# EAGLE design bristol_longshot (EAGLE 6.5.0)
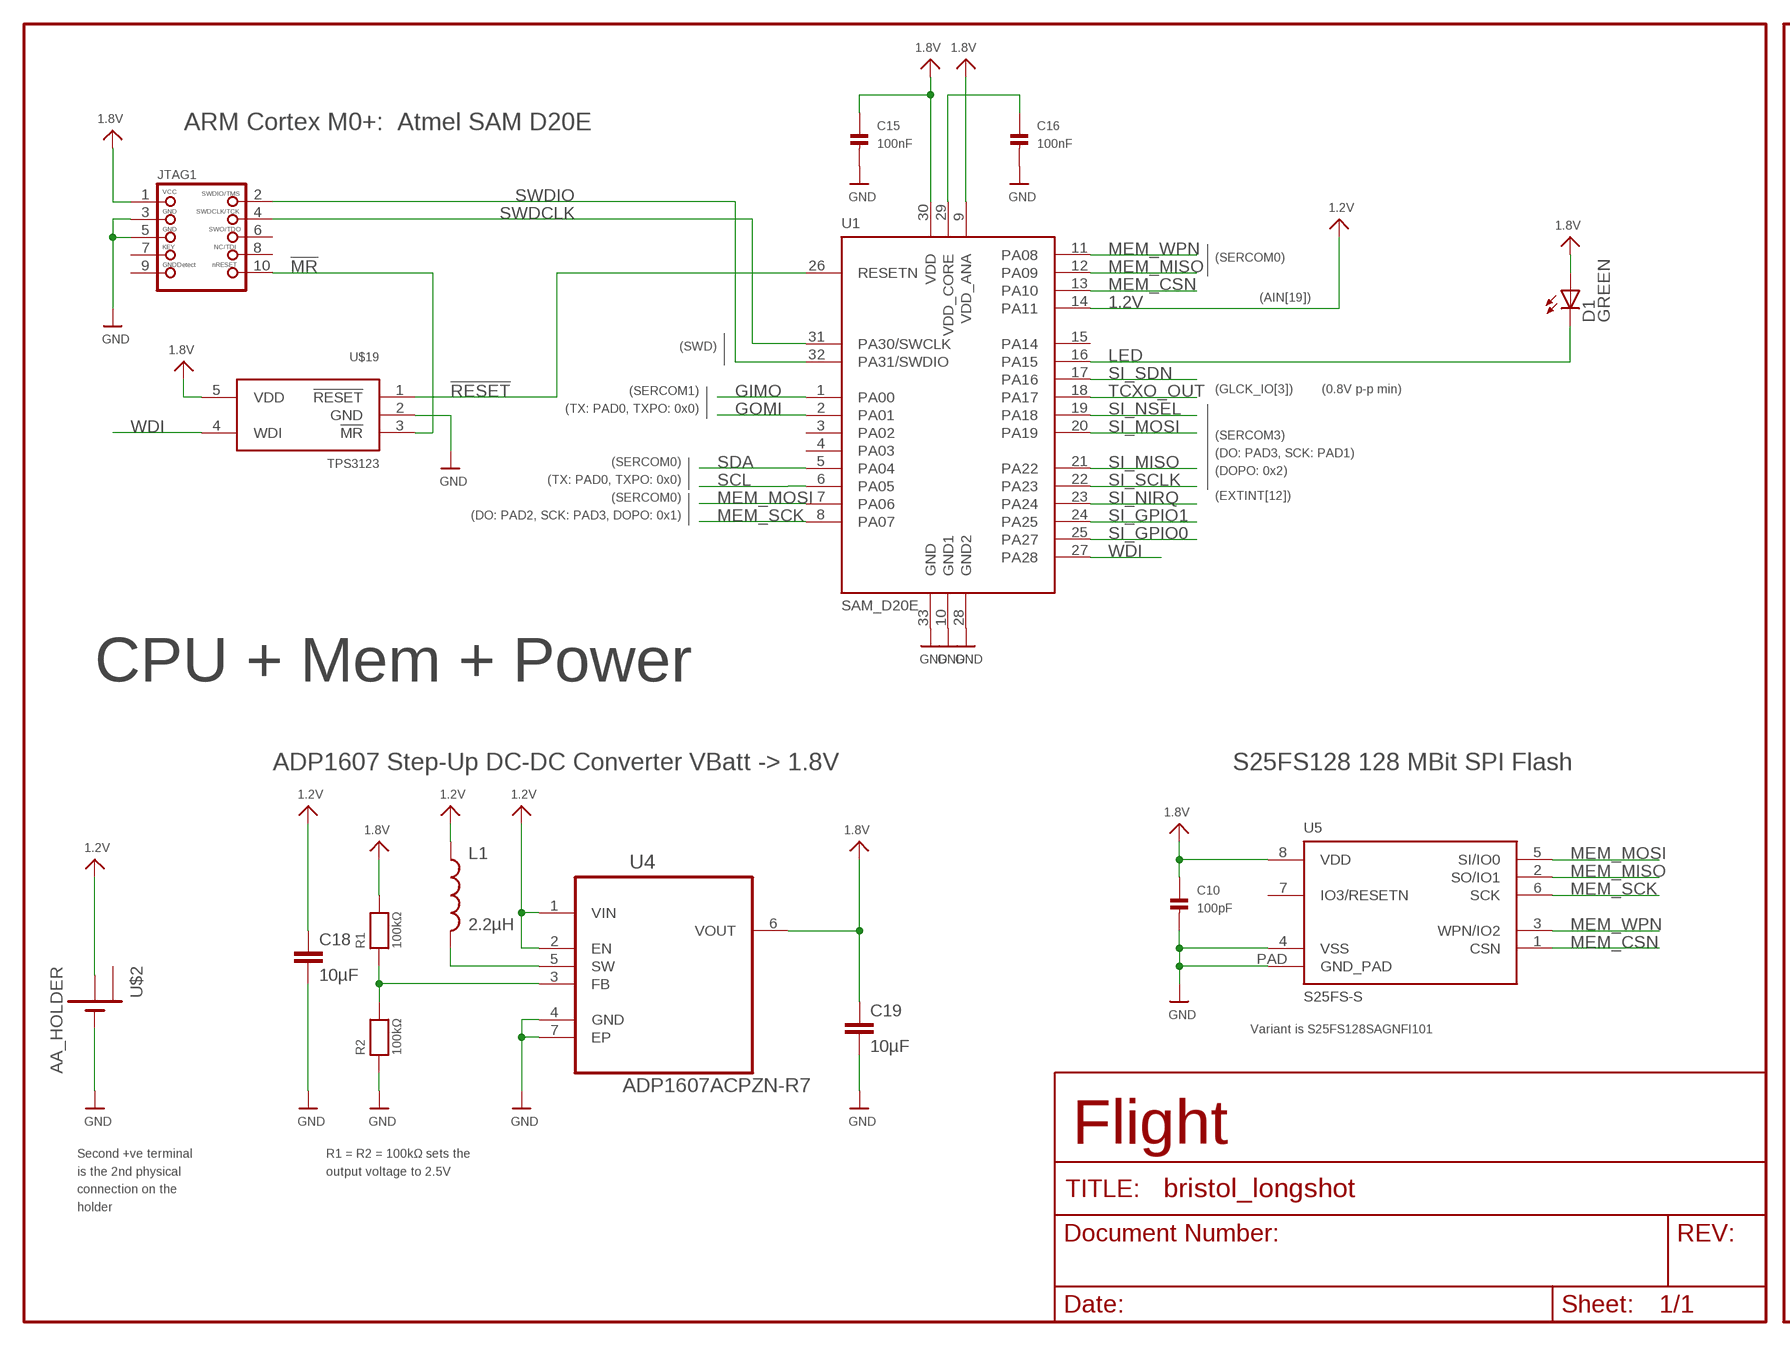
[diagram p0: schematic, sheet 1, part 1 of 2]
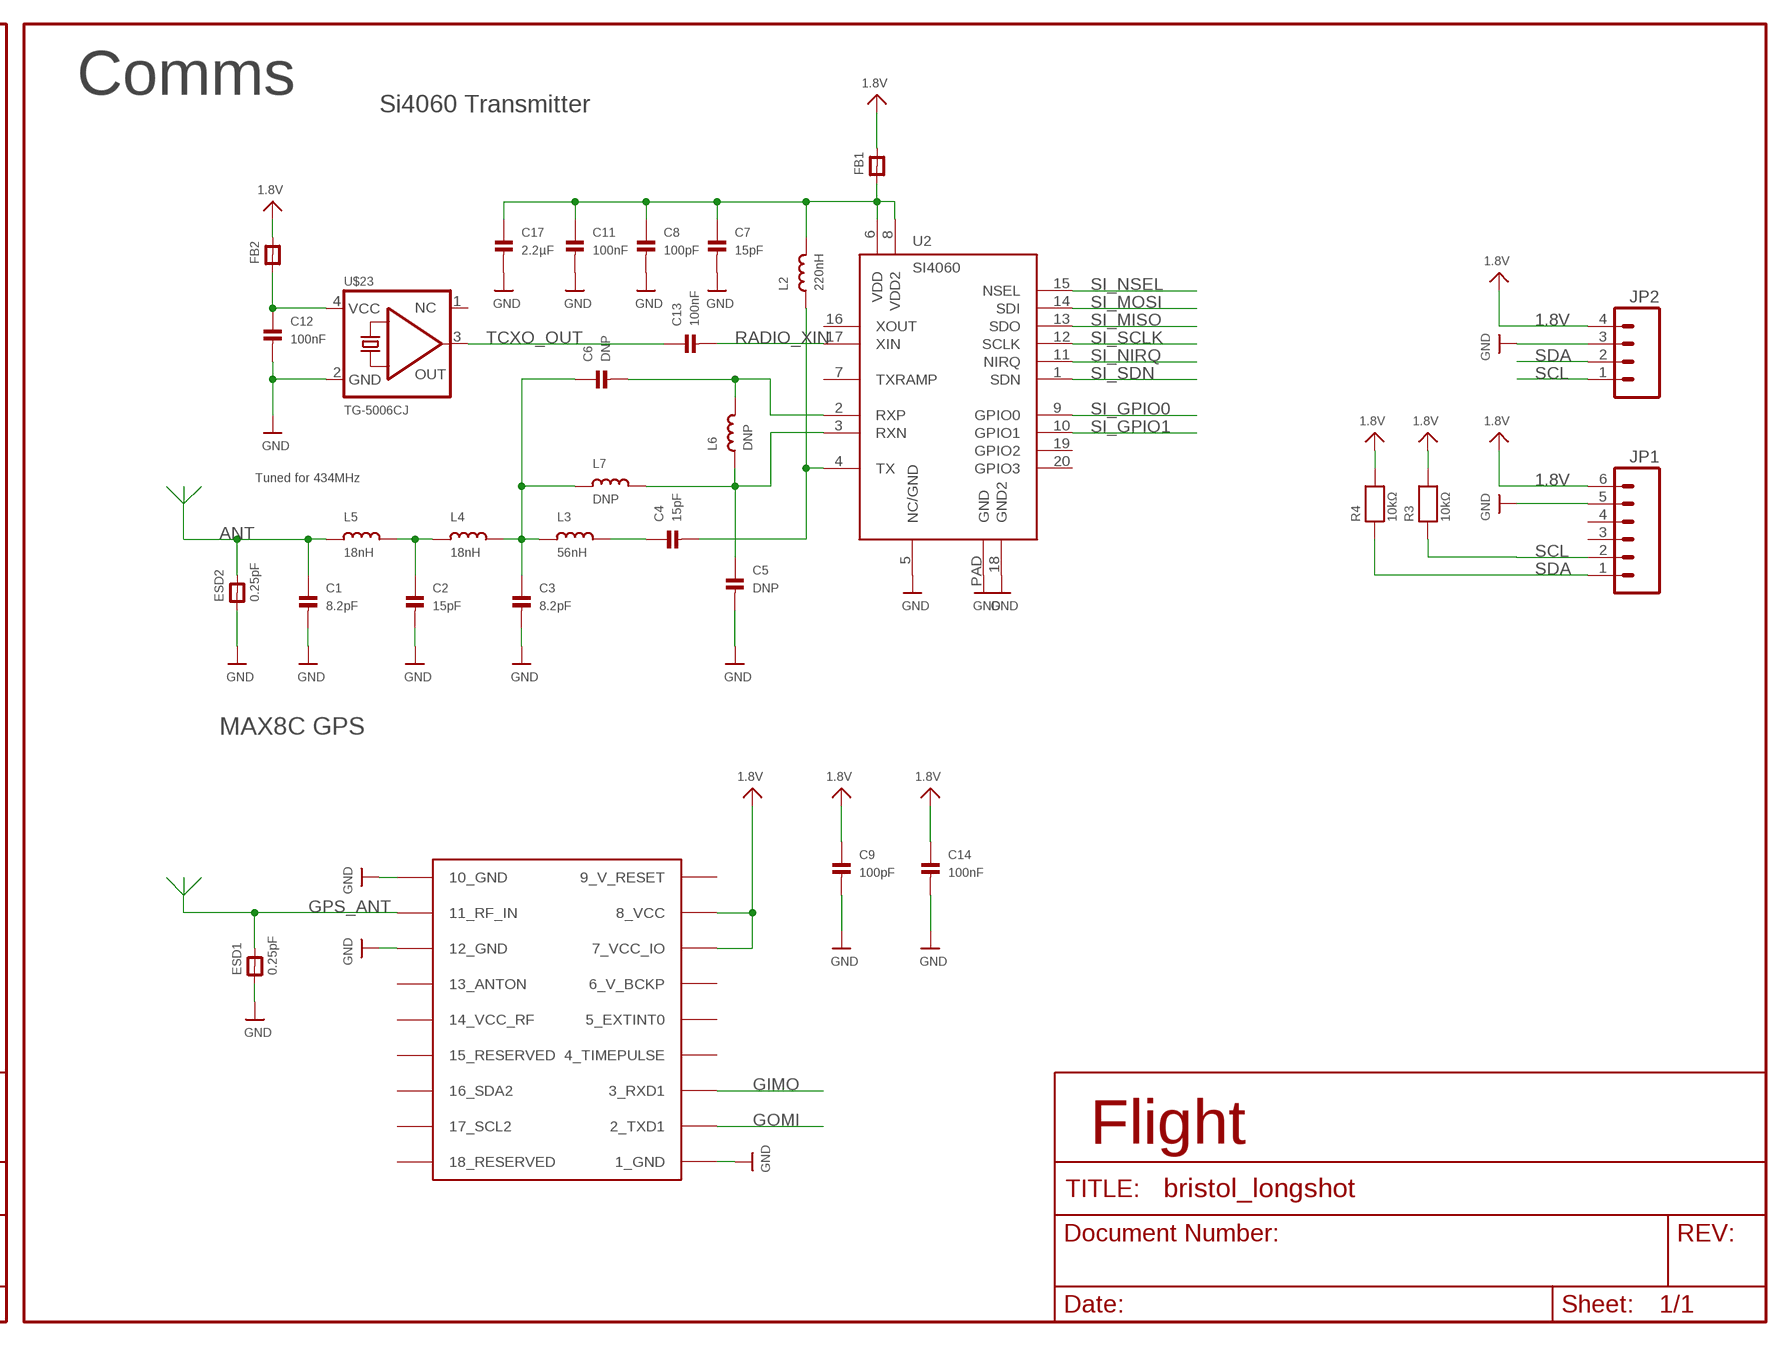
[diagram p1: schematic, sheet 1, part 2 of 2]

## Parts
C1  8.2pF  CAP_CERAMIC_0402  [_0402]
C2  15pF  CAP_CERAMIC_0402  [_0402]
C3  8.2pF  CAP_CERAMIC_0402  [_0402]
C4  15pF  CAP_CERAMIC_0402  [_0402]
C5  DNP  CAP_CERAMIC_0402  [_0402]
C6  DNP  CAP_CERAMIC_0402  [_0402]
C7  15pF  CAP_CERAMIC_0402  [_0402]
C8  100pF  CAP_CERAMIC_0402  [_0402]
C9  100pF  CAP_CERAMIC_0402  [_0402]
C10  100pF  CAP_CERAMIC_0402  [_0402]
C11  100nF  CAP_CERAMIC_0402  [_0402]
C12  100nF  CAP_CERAMIC_0402  [_0402]
C13  100nF  CAP_CERAMIC_0402  [_0402]
C14  100nF  CAP_CERAMIC_0402  [_0402]
C15  100nF  CAP_CERAMIC_0402  [_0402]
C16  100nF  CAP_CERAMIC_0402  [_0402]
C17  2.2µF  CAP_CERAMIC_0402  [_0402]
C18  10µF  C-EUC0603K  [C0603K]
C19  10µF  C-EUC0603K  [C0603K]
D1  GREEN  LEDCHIPLED_0603  [CHIPLED_0603]
ESD1  0.25pF  FERRITE_0603MP  [_0603MP]
ESD2  0.25pF  FERRITE_0603MP  [_0603MP]
FB1  FERRITE_0402  [_0402]
FB2  FERRITE_0402  [_0402]
JP1  M06LOCK  [1X06_LOCK]
JP2  M04LOCK  [1X04_LOCK]
JTAG1  JTAG-CORTEXM3SMT  [2X05_1.27MM_SMT]
L1  2.2µH  INDUCTOR1007  [1007]
L2  220nH  INDUCTOR_0402  [_0402]
L3  56nH  INDUCTOR_0402  [_0402]
L4  18nH  INDUCTOR_0402  [_0402]
L5  18nH  INDUCTOR_0402  [_0402]
L6  DNP  INDUCTOR_0402  [_0402]
L7  DNP  INDUCTOR_0402  [_0402]
R1  100kΩ  RESISTOR_0402  [_0402]
R2  100kΩ  RESISTOR_0402  [_0402]
R3  10kΩ  RESISTOR_0402  [_0402]
R4  10kΩ  RESISTOR_0402  [_0402]
U1  SAM_D20E  [QFN32_5MM]
U2  SI4060  [QFN20]
U4  ADP1607ACPZN-R7  [DFN200X200X60-7N]
U5  S25FS-S  [WSON8]
U$2  AA_HOLDER  [AA]
U$19  TPS3123  [SOT23-5]
U$23  TG-5006CJ  [TC-5006CJ]
U$48  UBLOX_MAX  [UBLOX_MAX]

## Nets
1.2V: C18.1 L1.1 U1.14(PA11) U4.1(VIN) U4.2(EN) U$2.+2(+)
1.8V: C9.1 C10.1 C14.1 C15.1 C19.1 D1.A FB1.2 FB2.2 JP1.6 JP2.4 JTAG1.1 R1.2 R3.2 R4.2 U1.9(VDD_ANA) U1.30(VDD) U4.6(VOUT) U5.8(VDD) U$19.5(VDD) U$48.7_VCC_IO U$48.8_VCC
!MR: JTAG1.10 U$19.3(!MR)
!RESET: U1.26(RESETN) U$19.1(!RESET)
ANT: C1.1 ESD2.2 L5.1
FB: R1.1 R2.2 U4.3(FB)
FILTER1: C3.1 C6.1 L3.1 L4.2 L7.1
FILTER2: C2.1 L4.1 L5.2
GIMO: U1.1(PA00) U$48.3_RXD1
GND: C1.2 C2.2 C3.2 C5.2 C7.2 C8.2 C9.2 C10.2 C11.2 C12.2 C14.2 C15.2 C16.2 C17.2 C18.2 C19.2 ESD1.1 ESD2.1 JP1.5 JP2.3 JTAG1.3 JTAG1.5 R2.1 U1.10(GND1) U1.28(GND2) U1.33(GND) U2.5(NC/GND) U2.18(GND2) U2.PAD(GND) U4.4(GND) U4.7(EP) U5.4(VSS) U5.PAD(GND_PAD) U$2.-1(-) U$2.-2(-) U$19.2(GND) U$23.2(GND) U$48.1_GND U$48.10_GND U$48.12_GND
GOMI: U1.2(PA01) U$48.2_TXD1
GPS_ANT: ESD1.2 U$48.11_RF_IN
LED: D1.C U1.16(PA15)
MEM_CSN: U1.13(PA10) U5.1(CSN)
MEM_MISO: U1.12(PA09) U5.2(SO/IO1)
MEM_MOSI: U1.7(PA06) U5.5(SI/IO0)
MEM_SCK: U1.8(PA07) U5.6(SCK)
MEM_WPN: U1.11(PA08) U5.3(WPN/IO2)
RADIO_VDD: C7.1 C8.1 C11.1 C17.1 FB1.1 L2.2 U2.6(VDD) U2.8(VDD2)
RADIO_XIN: C13.2 U2.17(XIN)
RF_OUT: C4.2 L2.1 U2.4(TX)
RXN: C5.1 L6.1 L7.2 U2.3(RXN)
RXP: C6.2 L6.2 U2.2(RXP)
SCL: JP1.2 JP2.1 R3.1 U1.6(PA05)
SDA: JP1.1 JP2.2 R4.1 U1.5(PA04)
SI_GPIO0: U1.25(PA27) U2.9(GPIO0)
SI_GPIO1: U1.24(PA25) U2.10(GPIO1)
SI_MISO: U1.21(PA22) U2.13(SDO)
SI_MOSI: U1.20(PA19) U2.14(SDI)
SI_NIRQ: U1.23(PA24) U2.11(NIRQ)
SI_NSEL: U1.19(PA18) U2.15(NSEL)
SI_SCLK: U1.22(PA23) U2.12(SCLK)
SI_SDN: U1.17(PA16) U2.1(SDN)
SW: L1.2 U4.5(SW)
SWDCLK: JTAG1.4 U1.31(PA30/SWCLK)
SWDIO: JTAG1.2 U1.32(PA31/SWDIO)
TANK: C4.1 L3.2
TCXO_OUT: C13.1 U1.18(PA17) U$23.3(OUT)
TCXO_VDD: C12.1 FB2.1 U$23.4(VCC)
VDD_CORE: C16.1 U1.29(VDD_CORE)
WDI: U1.27(PA28) U$19.4(WDI)
Unconnected: JP1.3 JP1.4 JTAG1.6 JTAG1.7 JTAG1.8 JTAG1.9 U1.3(PA02) U1.4(PA03) U1.15(PA14) U2.7(TXRAMP) U2.16(XOUT) U2.19(GPIO2) U2.20(GPIO3) U5.7(IO3/RESETN) U$23.1(NC) U$48.4_TIMEPULSE U$48.5_EXTINT0 U$48.6_V_BCKP U$48.13_ANTON U$48.14_VCC_RF U$48.15_RESERVED U$48.16_SDA2 U$48.17_SCL2 U$48.18_RESERVED

## Notes on the sheet
- Comms
- Si4060 Transmitter
- ARM Cortex M0+:  Atmel SAM D20E
- (SERCOM0)
- (AIN[19])
- (SWD)
- (SERCOM1) | (GLCK_IO[3]) | (0.8V p-p min)
- (TX: PAD0, TXPO: 0x0)
- (SERCOM3)
- (DO: PAD3, SCK: PAD1)
- (SERCOM0)
- (DOPO: 0x2)
- (TX: PAD0, TXPO: 0x0) | Tuned for 434MHz
- (SERCOM0) | (EXTINT[12])
- (DO: PAD2, SCK: PAD3, DOPO: 0x1)
- CPU + Mem + Power
- MAX8C GPS
- ADP1607 Step-Up DC-DC Converter VBatt -> 1.8V | S25FS128 128 MBit SPI Flash
- Variant is S25FS128SAGNFI101
- Flight | Flight
- R1 = R2 = 100kΩ sets the
  output voltage to 2.5V
- Second +ve terminal
  is the 2nd physical
  connection on the
  holder

## Power pins joined to a net without a drawn wire
9_V_RESET: U$48.9_V_RESET
+2: U$2.+1(+2)

## Library data of the parts
C1-C17 = microbuilder_v3:CAP_CERAMIC: Ceramic Capacitors 0402 - 0402 Surface Mount Capacitors 16pF 50V 5% [Digikey: 445-4899-2-ND] 18pF 50V 5% [Digikey: 490-1281-2-ND] 22pF 50V 5% [Digikey: 490-1283-2-ND] 68pF 50V 5% [Digikey: 490-1289-2-ND] 0.1uF 10V 10% [Digikey: 490-1318-2-ND] 1.0uF 6.3V 10% [Digikey: 490-1320-2-ND] 0603 - 0603 Surface Mount Capacitors 16 pF 50V 5% [Digikey: 445-5051-2-ND] 22 pF 50V [Digikey: PCC220ACVTR-ND] 33 pF 50V 5% [Digikey: 490-1415-1-ND] 56pF 50V 5% [Digikey: 490-1421-1-ND] 220pF 50V 5% [Digikey: 445-1285-1-ND] 680 pF 50V 2200 pF 50V 5% C0G [Digikey: 445-1297-1-ND] 5600 pF 100V 5% X7R [Digikey: 478-3711-1-ND] 0.1 µF 25V 10% [Digikey: PCC2277TR-ND] 0.22 µF 16V 10% X7R [Digikey: 445-1318-1-ND] 1.0 µF 25V 10% [Digikey: 445-5146-2-ND] 0603 - RF Specific 3pF 250V +/-0.1pF RF [Digikey: 712-1347-1-ND] 18 pF 250V 5% [Digikey: 478-3505-1-ND or 712-1322-1-ND] 56 pF 250V 5% C0G RF [Digikey: 490-4867-1-ND] 68 pF 250V RF [Digikey: 490-4868-1-ND] 0805 - 0805 Surface Mount Capacitors 220 pF 250V 2% RF Ceramic Capacitor [Digikey: 712-1398-1-ND] 1000 pF 50V 2% NP0 Ceramic Capacitor [Digikey: 478-3760-1-ND] 0.1 µF 25V 10% Ceramic Capacitor [Digikey: PCC1828TR-ND] 1.0 µF 16V 10% Ceramic Capacitor[Digikey: 490-1691-2-ND] 10.0 µF 10V 10% Ceramic Capacitor[Digikey: 709-1228-1-ND] 10.0 uF 16V 10% Ceramic Capacitor [Digikey: 478-5165-2-ND] 47 uF 6.3V 20% Ceramic Capacitor [Digikey: 587-1779-1-ND or 399-5506-1-ND] 1206 - 1206 Surface Mount Capacitors 47uF 10V 20% Ceramic Capacitor [Digikey: 490-5528-1-ND or 399-5508-1-ND or 445-6010-1-ND] 100uF 6.3V -20%, +80% Y5V Ceramic Capacitor (Digikey: 490-4512-1-ND, Mouser: 81-GRM31CF50J107ZE1L)
C18 C19 = resistor:C-EU: CAPACITOR, European symbol
D1 = led:LED: LED OSRAM: - CHIPLED LG R971, LG N971, LY N971, LG Q971, LY Q971, LO R971, LY R971 LH N974, LH R974 LS Q976, LO Q976, LY Q976 LO Q996 - Hyper CHIPLED LW Q18S LB Q993, LB Q99A, LB R99A - SideLED LS A670, LO A670, LY A670, LG A670, LP A670 LB A673, LV A673, LT A673, LW A673 LH A674 LY A675 LS A676, LA A676, LO A676, LY A676, LW A676 LS A679, LY A679, LG A679 - Hyper Micro SIDELED® LS Y876, LA Y876, LO Y876, LY Y876 LT Y87S - SmartLED LW L88C, LW L88S LB L89C, LB L89S, LG L890 LS L89K, LO L89K, LY L89K LS L896, LA L896, LO L896, LY L896 - TOPLED LS T670, LO T670, LY T670, LG T670, LP T670 LSG T670, LSP T670, LSY T670, LOP T670, LYG T670 LG T671, LOG T671, LSG T671 LB T673, LV T673, LT T673, LW T673 LH T674 LS T676, LA T676, LO T676, LY T676, LB T676, LH T676, LSB T676, LW T676 LB T67C, LV T67C, LT T67C, LS T67K, LO T67K, LY T67K, LW E67C LS E67B, LA E67B, LO E67B, LY E67B, LB E67C, LV E67C, LT E67C LW T67C LS T679, LY T679, LG T679 LS T770, LO T770, LY T770, LG T770, LP T770 LB T773, LV T773, LT T773, LW T773 LH T774 LS E675, LA E675, LY E675, LS T675 LS T776, LA T776, LO T776, LY T776, LB T776 LHGB T686 LT T68C, LB T68C - Hyper Mini TOPLED® LB M676 - Mini TOPLED Santana® LG M470 LS M47K, LO M47K, LY M47K Source: http://www.osram.convergy.de LUXEON: - LUMILED® LXK2-PW12-R00, LXK2-PW12-S00, LXK2-PW14-U00, LXK2-PW14-V00 LXK2-PM12-R00, LXK2-PM12-S00, LXK2-PM14-U00 LXK2-PE12-Q00, LXK2-PE12-R00, LXK2-PE12-S00, LXK2-PE14-T00, LXK2-PE14-U00 LXK2-PB12-K00, LXK2-PB12-L00, LXK2-PB12-M00, LXK2-PB14-N00, LXK2-PB14-P00, LXK2-PB14-Q00 LXK2-PR12-L00, LXK2-PR12-M00, LXK2-PR14-Q00, LXK2-PR14-R00 LXK2-PD12-Q00, LXK2-PD12-R00, LXK2-PD12-S00 LXK2-PH12-R00, LXK2-PH12-S00 LXK2-PL12-P00, LXK2-PL12-Q00, LXK2-PL12-R00 Source: www.luxeon.com KINGBRIGHT: KA-3528ASYC Source: www.kingbright.com
ESD1 ESD2 FB1 FB2 = microbuilder_v3:FERRITE: Ferrite Bead 0603 MMZ1608B121C - 120 Ohm @ 100MHz, 600mA, 0.15 Ohm DC Resistance - Digikey: 445-2164-1-ND BK1608HW121-T - 120 Ohm, 600mA Ferrite Chip - Digikey: 587-1876-2-ND 0805 HZ0805B272R-10 - 2.7K Ohm @ 100MHz, 200mA, 0.8 Ohm DC Resistance - Digikey: 240-2504-1-ND (see also Murata BLM21BD272SN1L) MMZ2012Y152B - 1.5K Ohm @ 100MHz, 500mA, 0.4 Ohm DC Resistance - Digikey: 445-1560-1-ND - Mainly for high frequency (80-400MHz) MMZ2012R102A - 1K Ohm @ 100MHz, 500mA, 0.3 Ohm DC Resistance - Digikey: 445-1555-2-ND - More general purpose (10-200MHz)
JP1 = SparkFun:M06: Header 6 Standard 6-pin 0.1" header. Use with straight break away headers (SKU : PRT-00116), right angle break away headers (PRT-00553), swiss pins (PRT-00743), machine pins (PRT-00117), and female headers (PRT-00115). Molex polarized connector foot print use with SKU : PRT-08094 with associated crimp pins and housings. NOTES ON THE VARIANTS LOCK and LOCK_LONGPADS... This footprint was designed to help hold the alignment of a through-hole component (i.e. 6-pin header) while soldering it into place. You may notice that each hole has been shifted either up or down by 0.005 of an inch from it's more standard position (which is a perfectly straight line). This slight alteration caused the pins (the squares in the middle) to touch the edges of the holes. Because they are alternating, it causes a "brace" to hold the component in place. 0.005 has proven to be the perfect amount of "off-center" position when using our standard breakaway headers. Although looks a little odd when you look at the bare footprint, once you have a header in there, the alteration is very hard to notice. Also, if you push a header all the way into place, it is covered up entirely on the bottom side. This idea of altering the position of holes to aid alignment will be further integrated into the Sparkfun Library for other footprints. It can help hold any component with 3 or more connection pins.
JP2 = SparkFun:M04: Header 4 Standard 4-pin 0.1" header. Use with straight break away headers (SKU : PRT-00116), right angle break away headers (PRT-00553), swiss pins (PRT-00743), machine pins (PRT-00117), and female headers (PRT-00115). Molex polarized connector foot print use with SKU : PRT-08231 with associated crimp pins and housings. 1MM SMD Version SKU: PRT-10208
JTAG1 = microbuilder_v3:JTAG-CORTEXM3: Serial Wire (SW-DP) Connector This standard 0.05" 10-pin connector is for use with the Cortex M0/M3's native SWD (serial wire debugger) interface (SW-DP). Some boards support a 20-pin combined JTAG+SWD connector (SWJ-DP), such as the LPC1700 family, but many smaller devices only work with SWD which typically use the smaller 10-pin SW-DP connecter (the LPC1300 family, for example, only supports SWD). 2x05 1.27mm/0.05" Connector: This is the standard SMT connector defined by ARM for all Cortex devices, and should be used in most situations and for forward-compatibility since any new devices coming to market will likely use this connector. MOLEX 10 Pin 0.1" Connector: This 0.1" 10 pin connector has the same pin layout as the standard 0.05" connector, but is easier to work with if you are using standard jumper wires or custom cables to connect your SWD hardware. MOLEX 20 Pin 0.1" Connector: This 0.1" 20 pin connector is the same model used for ARM7/ARM9 JTAG debuggers, but is connected to match the pins on the Segger J-Link for ARM (which supports both JTAG and SWD debugging). See the following document from ARM for more information on Cortex M3 Debug Connectors: http://infocenter.arm.com/help/topic/com.arm.doc.faqs/attached/13634/cortex_debug_connectors.pdf And the following page for an overview with images of the different connector types: http://www.keil.com/peripherals/coresight/connectors.asp
L1 = SparkFun:INDUCTOR: Inductors
L2-L7 = microbuilder_v3:INDUCTOR: Inductors
R1-R4 = microbuilder_v3:RESISTOR: Resistors 0402 - 0402 Surface Mount Package 22 Ohm 1% 1/16W [Digikey: 311-22.0LRTR-ND] 33 Ohm 5% 1/16W 1.0K 5% 1/16W 1.5K 5% 1/16W 2.0K 1% 1/16W 10.0K 1% 1/16W [Digikey: 311-10.0KLRTR-ND] 10.0K 5% 1/16W [Digikey: RMCF0402JT10K0TR-ND] 12.1K 1% 1/16W [Digikey: 311-22.0LRTR-ND] 100.0K 5% 1/16W 0603 - 0603 Surface Mount Package 0 Ohm 1/10 Watt 1% Resistor 15 Ohm 1/10 Watt 1% Resistor 33 Ohm 1/10 Watt 1% Resistor 49.9 Ohm 1/10 Watt 1% Resistor 100 Ohm 1/10 Watt 1% Resistor 150 Ohm 1/10 Watt 1% Resistor 240 Ohm 1/10 Watt 1% Resistor 390 Ohm 1/10 Watt 1% Resistor 560 Ohm 1/10 Watt 1% Resistor 680 Ohm 1/10 Watt 1% Resistor 750 Ohm 1/10 Watt 1% Resistor 1.0K Ohm 1/10 Watt 1% Resistor 1.5K Ohm 1/10 Watt 1% Resistor 2.0K Ohm 1/10 Watt 1% Resistor 2.2K Ohm 1/10 Watt 1% Resistor 3.3K Ohm 1/10 Watt 1% Resistor 4.7K Ohm 1/10 Watt 1% Resistor 10.0K Ohm 1/10 Watt 1% Resistor 12.0K Ohm 1/10 Watt 1% Resistor 12.1K Ohm 1/10 Watt 1% Resistor 20.0K Ohm 1/10 Watt 1% Resistor 33.0K Ohm 1/10 Watt 1% Resistor 100.0K Ohm 1/10 Watt 1% Resistor 0805 - 0805 Surface Mount Package 0 Ohm 1/8 Watt 1% Resistor 33 Ohm 1/8 Watt 1% Resistor 100 Ohm 1/8 Watt 1% Resistor 150 Ohm 1/8 Watt 1% Resistor 200 Ohm 1/8 Watt 1% Resistor 240 Ohm 1/8 Watt 1% Resistor 330 Ohm 1/8 Watt 1% Resistor 390 Ohm 1/8 Watt 1% Resistor 470 Ohm 1/8 Watt 1% Resistor 1.0K Ohm 1/8 Watt 1% Resistor 1.5K Ohm 1/8 Watt 1% Resistor 2.0K Ohm 1/8 Watt 1% Resistor 4.7K Ohm 1/8 Watt 1% Resistor 5.1K Ohm 1/8 Watt 1% Resistor 5.6K Ohm 1/8 Watt 1% Resistor 10.0K Ohm 1/8 Watt 1% Resistor 22.0K Ohm 1/8 Watt 1% Resistor 33.0K Ohm 1/8 Watt 1% Resistor 100K Ohm 1/8 Watt 1% Resistor 1206 - 1206 Surface Mount Package 2012 - 2010 Surface Mount Package 0.11 Ohm 1/2 Watt 1% Resistor - Digikey: RHM.11UCT-ND
U1 = fbri:SAM_D20E
U2 = fbri:SI4060
U4 = ADP1607:ADP1607ACPZN-R7: IC BOOST, 0.8-3.3V, 2MHZ, 1.8-3.3V, 6LFCSP; MPN: ADP1607ACPZN-R7; OC_FARNELL: 2254940; OC_NEWARK: 54W6610; PACKAGE: 6LFCSP; SUPPLIER: ANALOG DEVICES
U5 = fbri:S25FS-S
U$2 = fbri:AA_HOLDER
U$19 = TPS3125:TPS3123
U$23 = fbri:TG-5006CJ
U$48 = Ava:UBLOX_MAX: UBLOX MAX

## Board
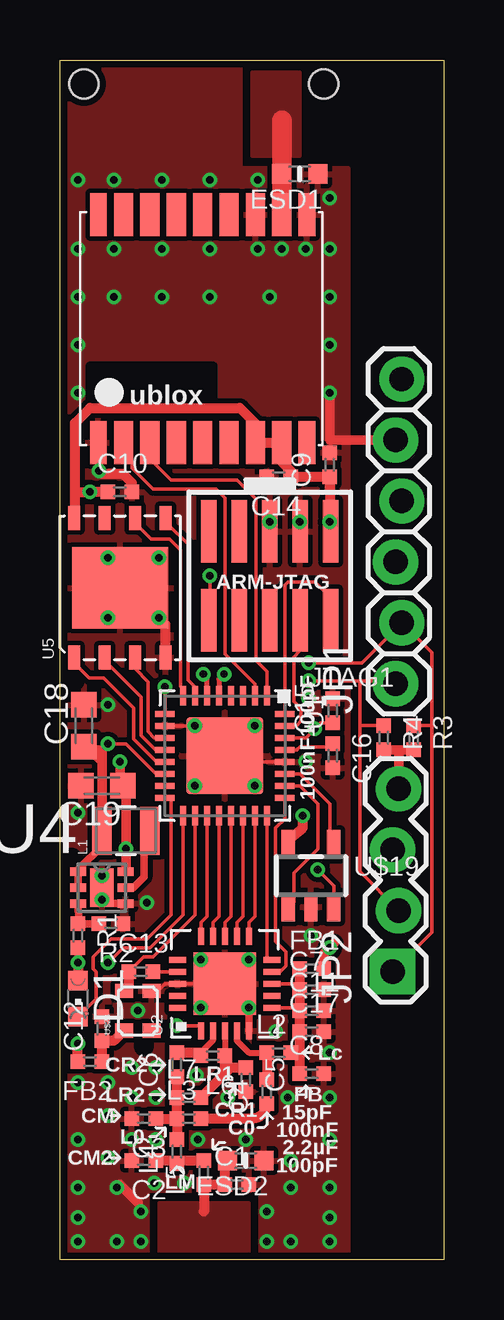
[diagram p2: board, top side]
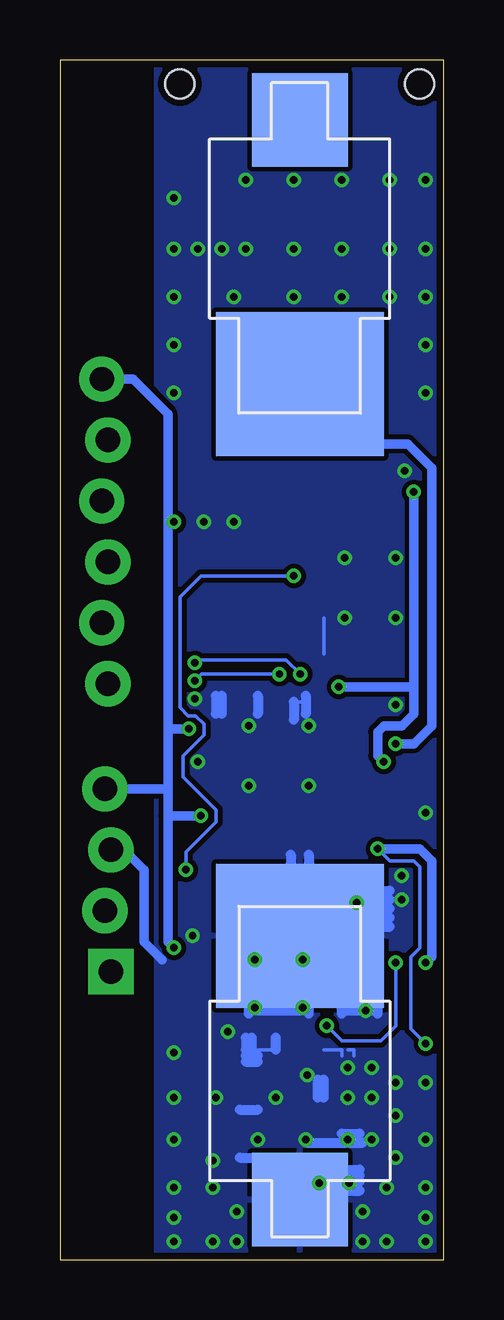
[diagram p3: board, bottom side, seen from below]

Size 16 x 50 mm. Coordinates in mm from the lower left corner, seen from the top.
Outline: 0,0 0,50 16,50 16,0 0,0
Copper layers (1*16): Top 0.035mm / dielectric 1.5mm / Bottom 0.035mm
Design rules "PCB-POOL Standard *": minimum track width 0.15mm, minimum drill 0.3mm, track to track 0.15mm, track to pad 0.15mm, pad to pad 0.15mm, via to via 0.15mm, smd to smd 0.15mm, copper to edge 0.3mm, drill to drill 0.2mm, minimum pad ring 0.2mm, minimum via ring 0.15mm, stop-mask expansion 0.075mm, vias tented up to drill 0.3mm, thermal gap 0.2mm
Holes 1.2 mm at 1,49 11,49
tRestrict: area 1.2,35.9 to 6.4,37.2; area 0.5,24 to 0.7,24.2; area 0.4,16.6 to 0.6,16.9; area 5.3,9.2 to 5.5,9.3; area 3.4,8.8 to 3.6,9

### Footprints (pad centres in the part's own frame; a part is rotated, then mirrored left to right if it is on the bottom)
_0402 = smd 0.6 x 0.6: 1 -0.508,0; 2 0.508,0
C0603K = smd 1.05 x 1.08: 1 -0.875,0; 2 0.875,0
CHIPLED_0603 = smd 0.8 x 0.8: A 0,-0.75; C 0,0.75
_0603MP = smd 0.8 x 0.8: 1 -0.762,0; 2 0.762,0
1X06_LOCK = drill 1.016 pad 1.88: 1 0,0; 2 2.54,-0.254; 3 5.08,0; 4 7.62,-0.254; 5 10.16,0; 6 12.7,-0.254
1X04_LOCK = drill 1.016 pad 1.88 square: 1 0,0.127 | drill 1.016 pad 1.88: 2 2.54,-0.127; 3 5.08,0.127; 4 7.62,-0.127
2X05_1.27MM_SMT = smd 0.65 x 2.6: 1 -2.54,-1.85; 2 -2.54,1.85; 3 -1.27,-1.85; 4 -1.27,1.85; 5 0,-1.85; 6 0,1.85; 7 1.27,-1.85; 8 1.27,1.85; 9 2.54,-1.85; 10 2.54,1.85
1007 = smd 2 x 0.8: 1 0,1; 2 0,-1
QFN32_5MM = smd 0.8 x 0.25: 1 -2.5,1.75; 2 -2.5,1.25; 3 -2.5,0.75; 4 -2.5,0.25; 5 -2.5,-0.25; 6 -2.5,-0.75; 7 -2.5,-1.25; 8 -2.5,-1.75; 17 2.5,-1.75; 18 2.5,-1.25; 19 2.5,-0.75; 20 2.5,-0.25; 21 2.5,0.25; 22 2.5,0.75; 23 2.5,1.25; 24 2.5,1.75 | smd 0.25 x 0.8: 9 -1.75,-2.5; 10 -1.25,-2.5; 11 -0.75,-2.5; 12 -0.25,-2.5; 13 0.25,-2.5; 14 0.75,-2.5; 15 1.25,-2.5; 16 1.75,-2.5; 25 1.75,2.5; 26 1.25,2.5; 27 0.75,2.5; 28 0.25,2.5; 29 -0.25,2.5; 30 -0.75,2.5; 31 -1.25,2.5; 32 -1.75,2.5 | smd 3.2 x 3.2: 33 0,0
QFN20 = smd 0.7 x 0.25: 1 -1.97,1; 2 -1.97,0.5; 3 -1.97,0; 4 -1.97,-0.5; 5 -1.97,-1; 11 1.97,-1; 12 1.97,-0.5; 13 1.97,0; 14 1.97,0.5; 15 1.97,1 | smd 0.25 x 0.7: 6 -1,-1.97; 7 -0.5,-1.97; 8 0,-1.97; 9 0.5,-1.97; 10 1,-1.97; 16 1,1.97; 17 0.5,1.97; 18 0,1.97; 19 -0.5,1.97; 20 -1,1.97 | smd 2.6 x 2.6: PAD 0,0
DFN200X200X60-7N = smd 0.66 x 0.356: 1 -0.991,0.66; 2 -0.991,0; 3 -0.991,-0.66; 4 0.991,-0.66; 5 0.991,0; 6 0.991,0.66 | smd 0.991 x 1.6: 7 0,0
WSON8 = smd 1 x 0.5: 1 -2.9,1.905; 2 -2.9,0.635; 3 -2.9,-0.635; 4 -2.9,-1.905; 5 2.9,-1.905; 6 2.9,-0.635; 7 2.9,0.635; 8 2.9,1.905 | smd 3.4 x 4: PAD 0,0
AA = smd 4 x 3.9: +1 0,22.5; -1 0,-22.5 | smd 7 x 6: +2 0,11.5; -2 0,-11.5
SOT23-5 = smd 0.55 x 1.2: 1 -0.95,-1.3; 2 0,-1.3; 3 0.95,-1.3; 4 0.95,1.3; 5 -0.95,1.3
TC-5006CJ = smd 0.6 x 0.75: 1 -0.825,-0.565; 2 0.825,-0.565; 3 0.825,0.565; 4 -0.825,0.565
UBLOX_MAX = smd 1.8 x 0.7: 1_GND 4.95,-4.4; 9_V_RESET 4.95,4.3; 10_GND -4.55,4.3; 18_RESERVED -4.55,-4.4 | smd 1.8 x 0.8: 2_TXD1 4.95,-3.35; 3_RXD1 4.95,-2.25; 4_TIMEPULSE 4.95,-1.15; 5_EXTINT0 4.95,-0.05; 6_V_BCKP 4.95,1.05; 7_VCC_IO 4.95,2.15; 8_VCC 4.95,3.25; 11_RF_IN -4.55,3.25; 12_GND -4.55,2.15; 13_ANTON -4.55,1.05; 14_VCC_RF -4.55,-0.05; 15_RESERVED -4.55,-1.15; 16_SDA2 -4.55,-2.25; 17_SCL2 -4.55,-3.35

### Placement (x,y rotation side)
C1  7.38,3.12 0 top
C2  3.5,4.12 180 top
C3  3.5,5.88 180 top
C4  8.62,7 90 top
C5  7.75,7.5 270 top
C6  4.88,8.12 90 top
C7  10.5,11.25 0 top
C8  10.5,7.75 0 top
C9  11.25,33.12 90 top
C10  2.5,32 0 top
C11  10.5,10.38 0 top
C12  1.75,9.62 90 top
C13  3.38,12 0 top
C14  9.12,32.62 180 top
C15  11.38,22.88 90 top
C16  11.38,21 270 top
C17  10.5,9.5 0 top
C18  1,22.25 90 top
C19  1.75,19.75 180 top
D1  0.75,10.88 180 top
ESD1  10,45.25 180 top
ESD2  7.75,4.12 180 top
FB1  10.5,12.12 0 top
FB2  1.25,8.25 180 top
JP1  14,24 90 top
JP2  14,12 90 top
JTAG1  8.75,28.5 180 top
L1  2.75,17.88 90 top
L2  9.12,8.62 0 top
L3  5.38,5.88 0 top
L4  4.88,4.5 90 top
L5  6,3.62 90 top
L6  6.38,8.5 180 top
L7  5.38,6.75 0 top
R1  0.75,13.5 270 top
R2  240kΩ  [_0402]  2.12,14 180 top
R3  14.75,21.75 270 top
R4  13.5,21.75 270 top
U1  6.88,21 270 top
U2  6.88,11.5 90 top
U4  1.75,15.5 0 top
U5  2.5,28 90 top
U$2  6,25 0 bottom
U$19  10.47,16 0 top
U$23  3.25,10.38 90 top
U$48  6,39 270 top

### Tracks (layer width: path | path; a pad name or v marks a point on that pad's centre or on a via)
1.2V  (via drill 0.3)
  Top 0.152: U1.14 4,20.25 2.75,21.5 v2,21.5
  Top 0.305: U4.2 U4.1 0.79,16.29 1.75,17.25 L1.1
  Top 0.4: 1.75,20.75 1.75,21.12 | 1.75,21.12 1.75,21.25 v2,21.5 | 1.75,20.75 1.25,21.25 1.62,21.25 1.75,21.12 | 1.75,20.75 L1.1
  Top 0.406: C18.1 1.12,21.25 1.25,21.25
  Bottom 0.4: v2,21.5 1.25,21.5 0.5,22.25 0.5,33 1.5,34 3.5,34
  Bottom 0.406: 3.5,34 U$2.+2
1.8V  (via drill 0.3)
  Top 0.152: 0.59,30.59 U5.8 | 4.34,22.72 U1.9 v4.38,23.88 | U1.30 10.25,21.75 v10.62,22.12 10.87,22.37 C15.1
  Top 0.305: 2.71,19.66 C19.1 | R1.2 v0.75,12.38
  Top 0.4: FB1.2 11.01,12.76 v11.25,13 | v2.5,20.75 2.5,19.88 C19.1 | 2.71,19.66 2.75,19.62 v2.75,17.12 2.75,16.2 U4.6 | 14.13,21.24 JP2.4 | 14.13,21.24 R3.2 | R4.2 14.13,21.24
  Top 0.406: C9.1 v11.25,30.75 11.25,29.89 JTAG1.1 | C9.1 11.24,32 | U$19.5 9.5,17.35 9.5,17.5 10.12,18 v10.12,18.5 | 0.62,32 0.62,34.88 1.25,35.5 7.5,35.5 8.12,34.88 8.12,34.08 U$48.7_VCC_IO U$48.8_VCC 9.25,33.25 9.62,32.88 9.62,32.63 C14.1 C9.1 | FB2.2 0.74,8.87 v0.75,9 | v0.75,12.38 D1.A | 11.42,13.17 v11.25,13 | C10.1 v1.25,32 0.62,32 | U5.8 0.62,30.93 0.62,32
  Bottom 0.152: v0.75,9 1.38,9.62 1.38,12.62 1,13 1,16.38 1.25,16.62 2.25,16.62 v2.75,17.12
  Bottom 0.4: v11.25,30.75 11.5,30.75 | 11.5,30.75 11.5,22.12 | 11.5,22.12 11.5,19.62 | 11.5,19.62 11.5,18.5 | 11.5,18.5 11.5,13.25 v11.25,13 | v10.62,22.12 11.5,22.12 | v1.25,32 1.25,23.88 | 1.25,23.88 1.25,22.75 1.75,22.25 2.5,22.25 2.75,22 2.75,21 v2.5,20.75 | v4.38,23.88 1.25,23.88 | v2.75,17.12 1,17.12 0.5,16.62 0.5,12.62 v0.75,12.38 | v10.12,18.5 11.5,18.5 | JP2.4 11.5,19.62 | JP1.6 12.95,36.7 11.5,35.25 11.5,30.75
!MR  (via drill 0.3)
  Top 0.152: U$19.3 11.42,15.58 v10.75,16.25 | v6.25,28.5 6.25,26.19 JTAG1.10
  Bottom 0.152: v10.75,16.25 10.75,17 9.5,18.25 9.5,18.75 10.88,20.12 10.88,21 10,21.88 10,22.33 10.33,22.66 10.66,22.66 11,23 11,27.62 10.12,28.5 v6.25,28.5
!RESET
  Top 0.152: U$19.1 9.75,14.9 9.75,16.12 10.75,17.12 10.75,19 10,19.75 U1.26
ANT
  Top 0.406: 6,2 L5.1 C1.1 6.87,4 ESD2.2
  pour Top: 4.12,0 7.88,0 7.88,2.38 4.12,2.38
FB
  Top 0.305: U4.3 0.79,14.04 R1.1 R2.2
FILTER1
  Top 0.406: C6.1 4.87,7.62 L7.1 L3.1 | L3.1 4.88,6 L4.2 | C3.1 L3.1
FILTER2
  Top 0.406: C2.1 4.02,4.13 4.88,4.13 | 4.88,4.13 L5.2 | L4.1 4.88,4.13
GIMO
  Top 0.152: U1.1 8.62,24.52 8.18,24.97 8.18,31.7 7.38,32.5 4.62,32.5 3.96,33.16 3.96,33.53 3.75,33.74 U$48.3_RXD1
GND  (via drill 0.3)
  Top 0.152: U1.10 v5.62,22.25 U1.33 6.88,22.25 v8.12,22.25 | 5.88,11.25 5.62,11.5 U2.18 4.38,11.5 4.12,11.25 3.87,11.25 U$23.2 | U5.PAD 1.25,26.75 | 1.25,29.25 v2,29.25 v4.12,29.25 | U1.28 8.25,20.75 8.25,19.88 v8.12,19.75 | U2.PAD v7.88,12.5
  Top 0.305: 5.88,11.25 v5.88,10.5 | U2.5 v7.88,10.5 | U4.4 2.08,14.84 1.98,14.94 1.98,15.27 U4.7
  Top 0.4: JP1.5 11.25,34.16 v11.25,36.12
  Top 0.406: U5.4 4.41,26.47 v4.12,26.75 | 2.5,3.12 3.25,2.38 | U5.PAD 2.18,28 1.22,28.96 1.22,29.22 1.25,29.25 | C10.2 3.01,32.37 2.62,32.75 1.75,32.75 v1.62,32.88
  Bottom 0.152: 5,25.25 5,26.75 | 8,8.75 8.25,8.75 8.25,8.5 8.25,8.25 | 7.75,8.5 7.75,8.75 7,8.75 | 5,8.75 4.25,8.75 4.25,8.5 | 4,8.75 3.75,8.75 3.75,8.5 | 5.75,23.5 5.75,23.25 6.25,23.25 | 2.62,14.62 3.38,14.62 v3.62,14.88 | 2.62,15 3.5,15 v3.62,14.88 | 2.25,15.38 3.12,15.38 v3.62,14.88 | 2.62,13.88 v3.62,14.88 | 2.62,14.25 3,14.25 v3.62,14.88 | 4.25,10.25 3.38,10.25 v3.25,10.38 | v5.88,10.5 5.75,10.38 5.62,10.25
  Bottom 0.4: JP2.3 13.33,17.08 12.5,16.25 12.5,13.25 11.75,12.5
  Bottom 0.406: 7,8.75 7,9.25 | 8,8.75 8,9.25 | 8.25,8.5 7.75,8.5 | 8.25,9.25 8.25,8.75 | 8.25,8.25 7.75,8.25 | 5.25,6.75 5.25,7.5 | 5,6.75 5,7.5 | 5.75,4.88 3.38,4.88 | 4.25,5.25 3.5,5.25 | 8.5,6.25 7.75,6.25 | 4.25,3.75 3.5,3.75 | 4.25,3.5 3.5,3.5 | 8.5,4.25 7.75,4.25 | 5.75,23.5 5.75,22.75 | 6.25,23.25 6.25,22.5 | 9.5,23.5 9.5,22.75 | 9.25,22.75 9.25,23.5 | 7.75,23.5 7.75,22.75 | 4.25,3.25 3.5,3.25 | 4.25,2.88 3.5,2.88 | 2.75,10.38 v3.25,10.38 4.25,10.38 | 4.25,10.25 4.25,10.62 | 2.75,10.25 2.75,10.38 | 2.75,10.38 2.75,10.62 | 2.62,13.88 2.25,13.88 | 2.62,14.25 2.25,14.25 | 2.62,14.62 2.25,14.62 | 2.62,15 2.25,15 | 2.62,15.38 2.25,15.38 | 5.62,16.88 5.62,16.5 | 6.38,16.88 6.38,16.5 | 5.75,10.38 8,10.38 | 8,10.38 8.12,10.38 | 5.62,10.25 5.62,10.62 | 8.12,10.25 8.12,10.38 | 8.12,10.38 8.12,10.62 | v7.88,10.5 8,10.38 | v5.88,12.5 6,12.62 U$2.-2
  other vias: 8.75,30.75 10,30.75 5.62,19.75 10.38,23.38 9,9.5 0.75,3 0.75,1.75 0.75,0.75 2.38,0.75 3.38,0.75 3.38,2 2.38,3 8.62,0.75 9.62,0.75 11.25,0.75 11.25,1.75 11.25,3 9.62,3 8.62,2 2,26.75 5.69,7.69 0.75,5 0.75,7.38 4,8 4,5 2,4.25 11.25,5 9.5,6.75 7,6.75 2,6 3,5 5.75,5 9.62,4.12 7.75,5 11.25,6.75 11.25,8.62 3,6.75 4,6.75 5.19,3.19 3.94,3.19 10.25,20.75 2,23.12 0.75,18.62 1.75,16 1.75,15 10.47,13.5 3,8 2,7.38 10.25,42.12 8.25,42.12 11.25,44.25 11.25,42.12 9.25,42.12 6.25,42.12 4.25,42.12 2.25,45 2.25,42.12 0.75,42.12 0.75,45 0.75,40.12 0.75,38.12 0.75,36.12 11.25,40.12 11.25,38.12 2.25,40.12 4.25,40.12 6.25,40.12 8.75,40.12 4.25,45 6.25,45 8.25,45
  pour Top (isolate 0.2): 0,50 7.5,50 7.5,45.5 12,45.5 12,0 8.38,0 8.38,2.88 3.62,2.88 3.62,0 0,0
  pour Bottom (isolate 0.2): 0,50 12,50 12,0 0,0
GOMI
  Top 0.152: 2.65,33.62 U$48.2_TXD1 2.65,33.6 3,33.25 3,33 3.88,32.12 6.5,32.12 6.88,31.75 6.88,25.25 8.12,24 U1.2
GPS_ANT
  Top 0.406: U$48.11_RF_IN 9.25,45.24 ESD1.2
  Top 0.819: U$48.11_RF_IN 9.25,47.5
  pour Top: 8,46 10,46 10,49.5 8,49.5
LED
  Top 0.152: U1.16 4.62,19.25 4.62,14.38 3.62,13.38 2.12,13.38 1.38,12.62 1.38,12.12 1.5,12 1.5,10.88 D1.C
MEM_CSN
  Top 0.152: U1.13 4.02,20.75 3.08,21.7 3.08,22.98 1.83,24.23 1.22,24.23 0.59,24.86 U5.1
MEM_MISO
  Top 0.152: U1.12 3.98,21.25 3.38,21.85 3.38,23.44 1.86,24.96 U5.2
MEM_MOSI
  Top 0.152: U5.5 4.42,30.63 4.52,30.63 5.33,29.82 5.33,24.16 5.62,23.87 U1.7
MEM_SCK
  Top 0.152: U5.6 3.13,30.7 3.81,30.02 4.57,30.02 5.03,29.57 5.03,23.89 5.12,23.79 U1.8
MEM_WPN
  Top 0.152: U1.11 3.94,21.75 3.69,22 3.69,24.08 3.13,24.63 U5.3
RADIO_VDD
  Top 0.152: U2.8 9.87,11.5 C7.1 9.87,10.38 9.88,10.38 9.88,10.49 9.99,10.5 U2.6
  Top 0.406: FB1.1 C7.1 9.99,10.5 C11.1 C17.1 9.99,8.62 | 9.99,8.62 C8.1 | L2.2 9.99,8.62
RADIO_XIN
  Top 0.152: U2.17 C13.2
RF_OUT
  Top 0.254: U2.4 7.38,9.12 7.88,8.62 L2.1 8.68,8.75
  Top 0.406: L2.1 8.62,8.69 C4.2
RXN
  Top 0.254: U2.3 L6.1
  Top 0.406: L7.2 6.88,7.76 | 6.88,7.76 L6.1 | 6.88,7.76 7.13,8.01 C5.1
RXP
  Top 0.254: U2.2 6.38,9.13 5.88,8.63 | 5.88,8.63 L6.2 | 5.88,8.63 L6.2
  Top 0.406: C6.2 5.86,8.63 L6.2
SCL  (via drill 0.3)
  Top 0.152: v10.38,24.88 12.59,24.88 JP1.2 15.5,25.29 15.5,22.26 | JP2.1 15.5,13.63 15.5,22.26 | R3.1 15.5,22.26
  Top 0.2: U1.6 6.12,24.25 v5.98,24.4
  Bottom 0.152: v10.38,24.88 10.25,25 6.57,25 v5.98,24.4
SDA  (via drill 0.3)
  Top 0.152: v10.38,24.12 12.5,24.12 | 12.5,24.12 13.88,24.12 JP1.1 | JP2.2 12.5,16.17 12.5,22.25 12.5,22.26 | 12.5,22.26 12.5,24.12 | R4.1 12.5,22.26
  Top 0.2: v6.85,24.4 6.62,24.18 U1.5
  Bottom 0.152: v6.85,24.4 10.1,24.4 v10.38,24.12
SI_GPIO0
  Top 0.152: U2.9 9.19,12 9.42,12.24 9.42,12.83 8.99,13.26 8.99,17.98 9.38,18.37 U1.25 9.42,19.2
SI_GPIO1
  Top 0.152: U1.24 8.62,12.5 U2.10
SI_MISO
  Top 0.152: U2.13 6.88,14.04 7.12,14.29 U1.21
SI_MOSI
  Top 0.152: U2.14 6.38,14.04 6.62,14.29 U1.20
SI_NIRQ
  Top 0.152: U1.23 8.12,14.29 7.88,14.04 U2.11
SI_NSEL
  Top 0.152: U2.15 5.88,14.04 6.12,14.29 U1.19
SI_SCLK
  Top 0.152: U2.12 7.38,14.04 7.62,14.29 U1.22
SI_SDN  (via drill 0.3)
  Top 0.152: 5.88,9.72 U2.1 5.88,9.75 v4.88,9.75 | U1.17 5.12,14.38 3.75,13 2.62,13 v2,12.38
  Bottom 0.152: v2,12.38 2,9.75 2.62,9.12 4.25,9.12 v4.88,9.75
SW
  Top 0.305: L1.2 3.75,17.25 3.5,17 3.5,15.94 3.06,15.5 U4.5
SWDCLK
  Top 0.152: JTAG1.4 10.02,25.62 | 10.02,25.62 10.02,25.38 9.75,25.11 9.75,23.25 10.06,22.94 10.06,22.44 9.87,22.25 U1.31 | 10.06,25.59 10.02,25.62
SWDIO
  Top 0.152: 9.36,22.76 U1.32 9.38,28.12 9.5,28.25 10.63,28.25 11.29,27.59 JTAG1.2
TANK
  Top 0.406: C4.1 arc-90 8.01,5.88 L3.2
TCXO_OUT
  Top 0.152: C13.1 3.49,12.62 3.88,12.62 5.62,14.38 U1.18
  Top 0.406: C13.1 2.87,11.38 U$23.3
TCXO_VDD
  Top 0.406: FB2.1 1.76,8.98 C12.1 2.25,9.12 U$23.4
VDD_CORE
  Top 0.152: U1.29 9.88,21.25 9.88,21.26 10,21.38 11.24,21.38 C16.1
WDI
  Top 0.152: U1.27 10,20.25 11.25,19 11.25,17.5 U$19.4

### Text on the board
tPlace: ARM-JTAG | 100nF100pF | CR2 | Lc | LR2 | LR1 | CM | CR1 | L0 | C0 | CM2 | FB / 15pF / 100nF / / 100pF | 2.2µF | LM
tStop: UNIVERSITY | OF | BRISTOL | v0.96.0 | GPS | ublox
bStop: (C) Richard Meadows 2014